# EasyEDA schematic SCH_Pompe_2022-04-02.json
TITLE: Sheet_1; REV: 1.0; Date: 2022-03-05; Sheet: 1/1; Drawn By: vstebe; Company: Your Company
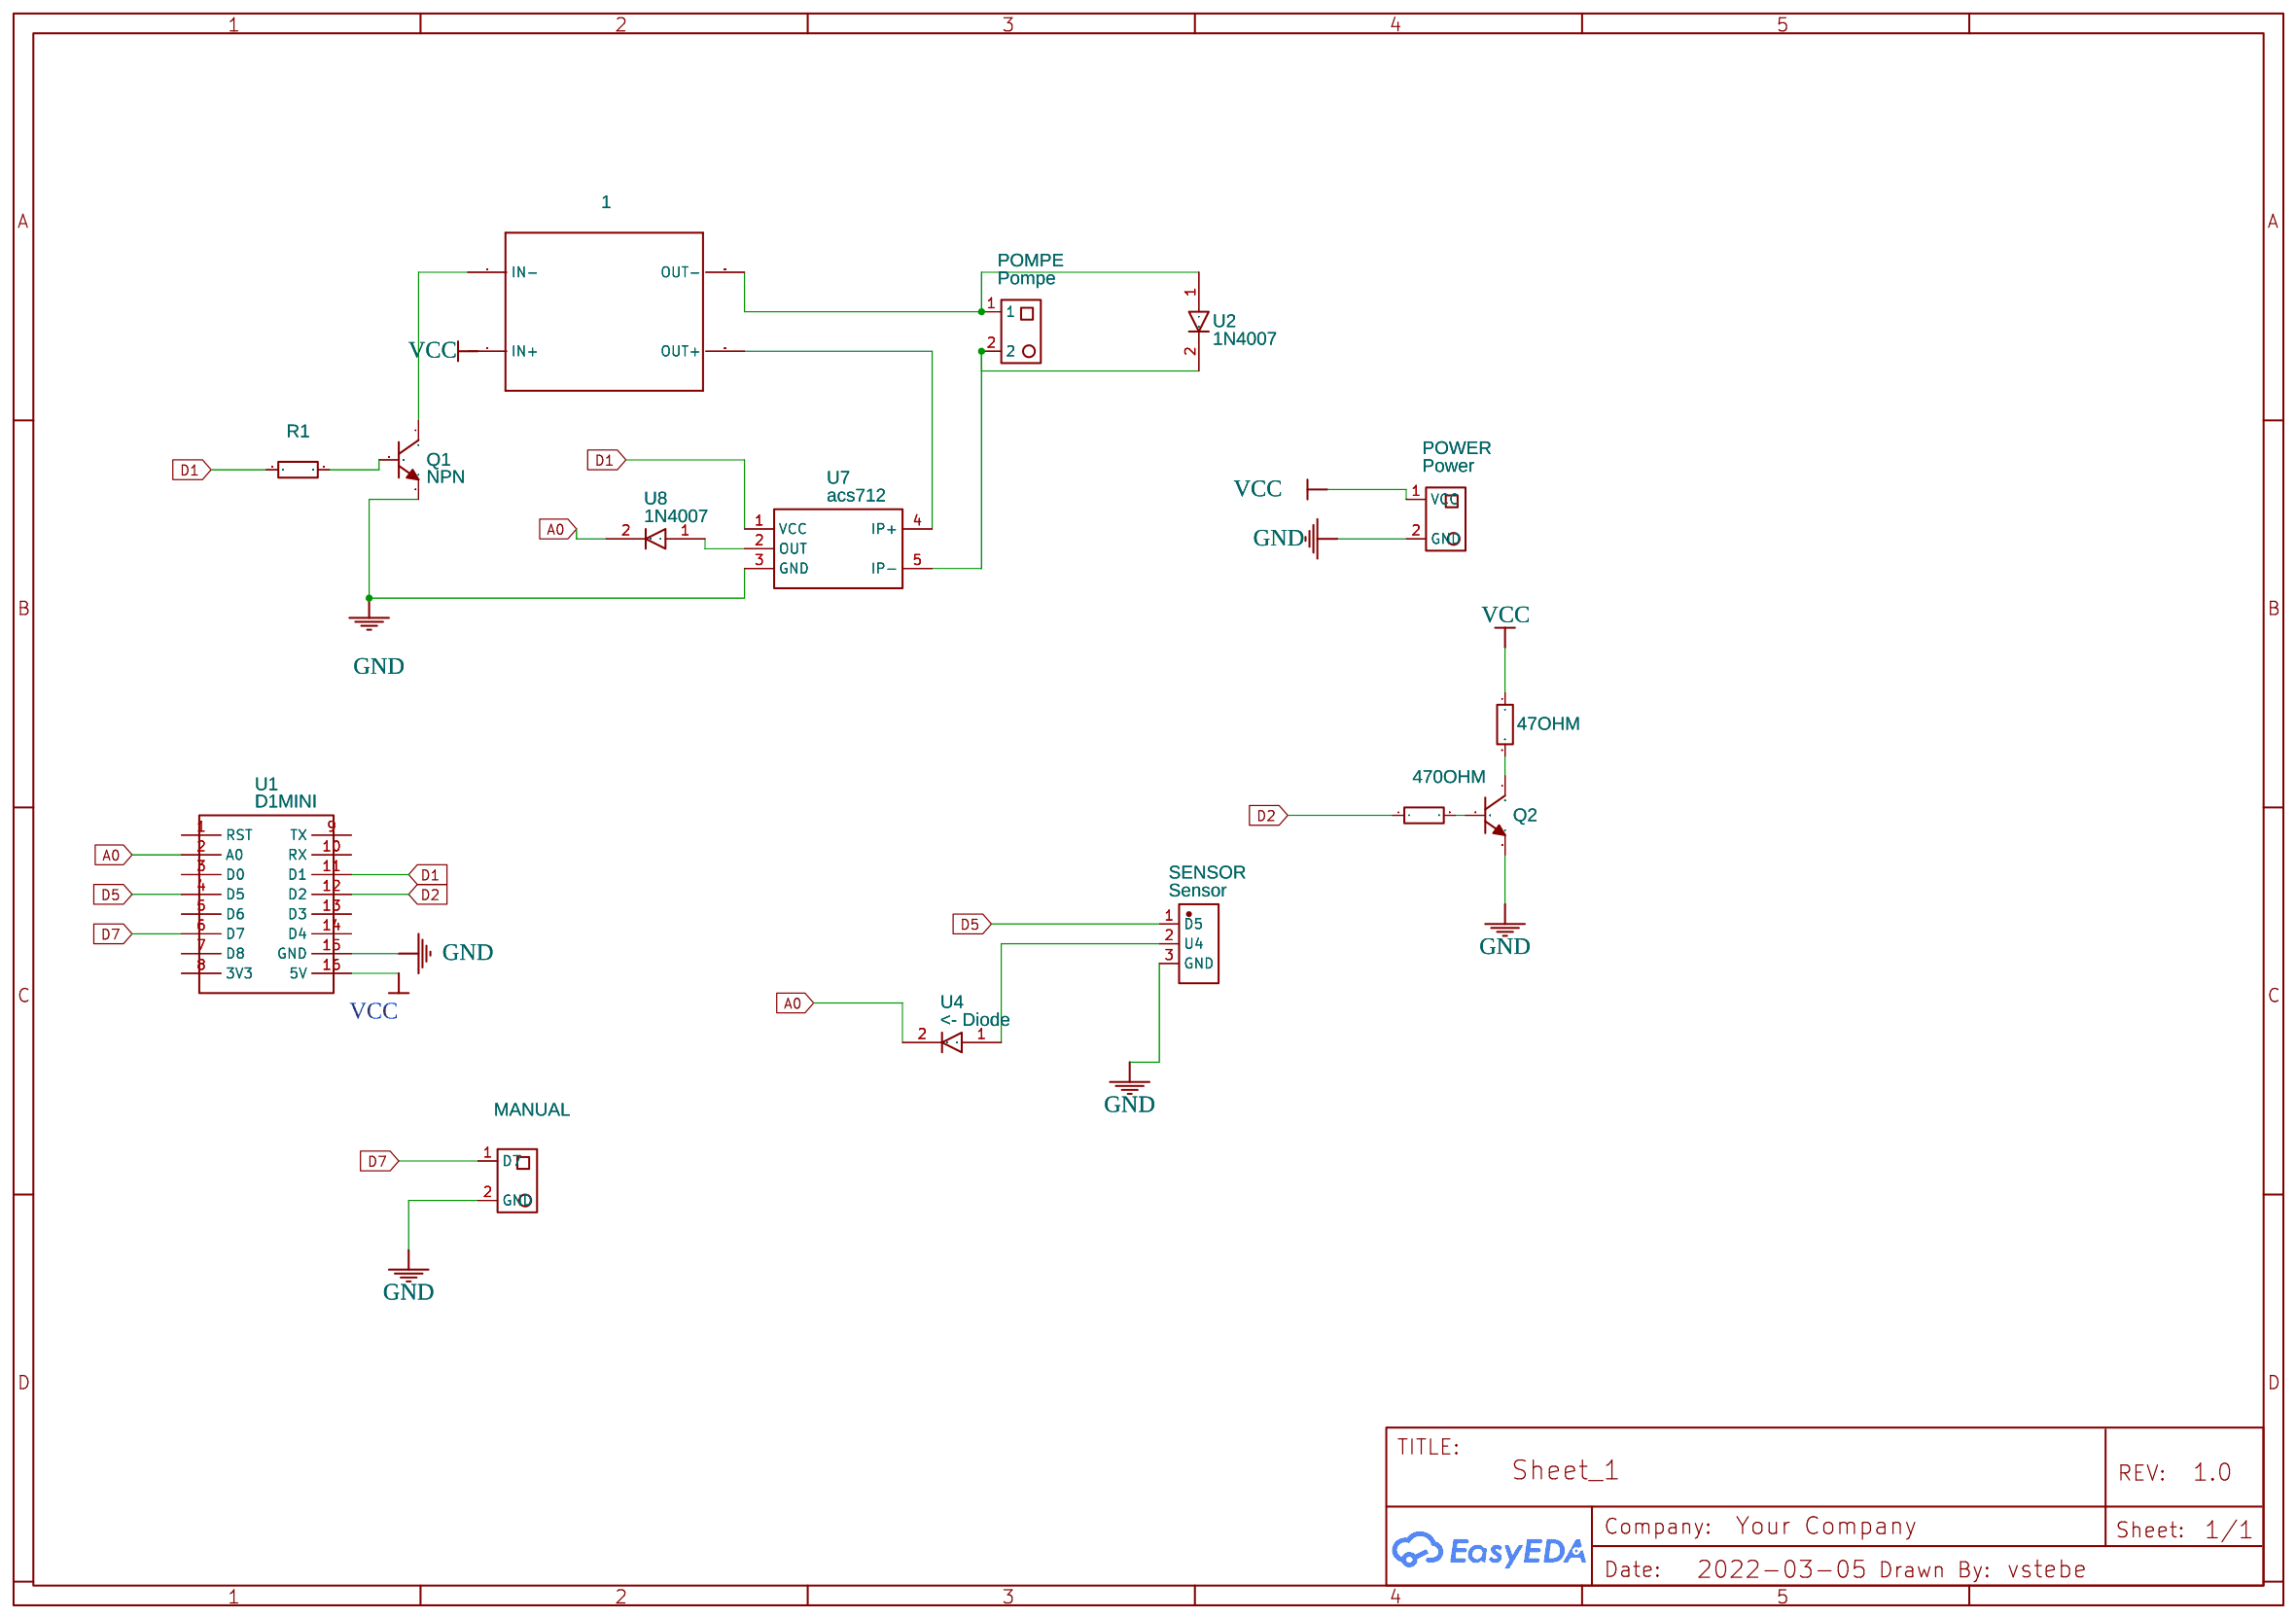
[diagram p0: schematic sheet]

## Parts
1  DC-DC-STEP-UP-MT3608  [DC-DC-STEP-UP-MT3608]
47OHM  ResistorToday  [AXIAL-0.6]
470OHM  ResistorToday  [AXIAL-0.6]
MANUAL  Manual  [TWO PIN CONNECTOR]
POMPE  Pompe  [TWO PIN CONNECTOR]
POWER  Power  [TWO PIN CONNECTOR]
Q1  NPN  [NPN-2N2222A]
Q2  2N2222A FACILE_A_souder  [NPN-2N2222A]
R1  ResistorToday  [AXIAL-0.6]
SENSOR  Sensor  [CONN-TH_3P-P2.50_JST3-2.5T-1-3A]
U1  D1MINI  [D1MINI]
U2  1N4007  [1N4007]
U4  <- Diode  [1N4007]
U7  acs712  [ACS712]
U8  1N4007  [1N4007]

## Library data of the parts
1 = DC-DC-STEP-UP-MT3608: Contributor: MAYURESH INAMDAR
47OHM 470OHM R1 = Resistor Normal: Supplier: LCSC; Supplier Part: X16151710; Manufacturer Part: EWWR0001J20R0T9; Contributor: elviisledesma
MANUAL POMPE POWER = JST XH 2 PIN: Contributor: vikaskumar
Q1 Q2 = 2N2222A FACILE_A_souder: Supplier: LCSC; Supplier Part: C358533; Manufacturer: Mauser; Manufacturer Part: 2N2222A; Contributor: khaliljdidi
SENSOR = JST3-2.5T-1-3A: Supplier: LCSC; Supplier Part: C9900006101; JLCPCB Part Class: Extended Part; Contributor: LCSC
U1 = D1MINI: Contributor: pulsartronic
U2 U4 U8 = 1N4007: Contributor: Hotte
U7 = acs712: Contributor: Scarart2539

## Nets
GND: MANUAL.2(GND) POWER.2(GND) Q1.3(E) Q2.3(E) SENSOR.3(GND) U1.15(GND) U7.3(GND)
VCC: 1.IN+ 47OHM.1 POWER.1(VCC) U1.16(5V)
A0: U1.2(A0) U4.2 U8.2
D1: R1.1 U1.11(D1) U7.1(VCC)
D2: 470OHM.1 U1.12(D2)
D5: SENSOR.1(D5) U1.4(D5)
D7: MANUAL.1(D7) U1.6(D7)
Net-(1-IN-): 1.IN- Q1.1(C)
Net-(1-OUT+): 1.OUT+ U7.4(IP+)
Net-(1-OUT-): 1.OUT- POMPE.1 U2.1
Net-(47OHM-2): 47OHM.2 Q2.1(C)
Net-(470OHM-2): 470OHM.2 Q2.2(B)
Net-(POMPE-2): POMPE.2 U2.2 U7.5(IP-)
Net-(Q1-2): Q1.2(B) R1.2
Net-(SENSOR-2): SENSOR.2(U4) U4.1
Net-(U7-2): U7.2(OUT) U8.1

Not connected (* = marked no-connect by the designer): U1 1(RST) 3(D0) 5(D6) 7(D8) 8(3V3) 9(TX) 10(RX) 13(D3) 14(D4)
